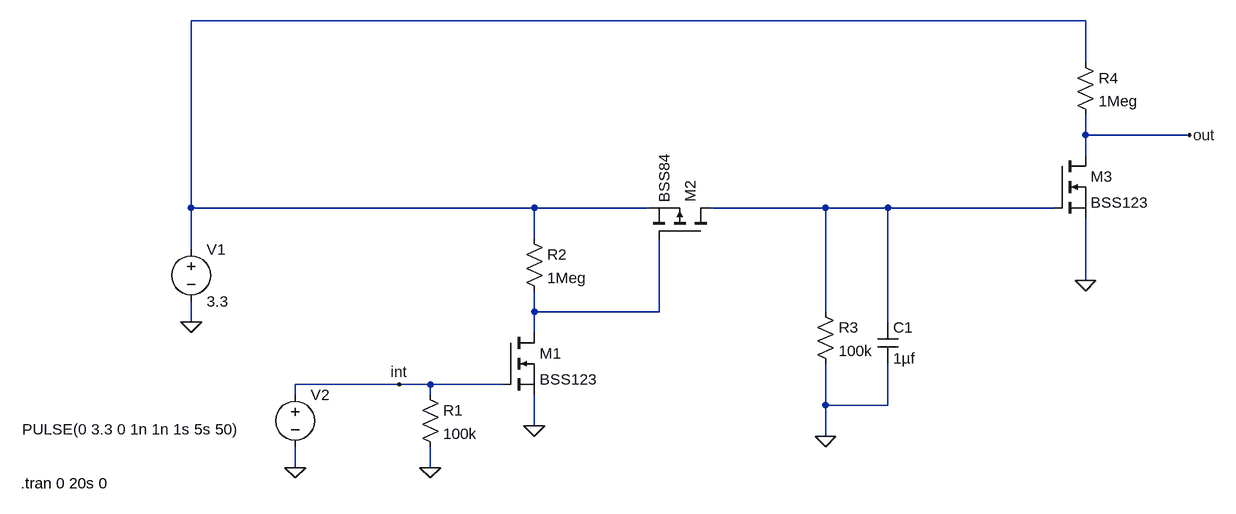
[diagram p0: schematic SW_DELAY.asc]
SW_DELAY.asc, the LTspice schematic file:
Version 4
SHEET 1 1336 680
WIRE 1120 -288 -256 -288
WIRE 1120 -224 1120 -288
WIRE 1120 -112 1120 -144
WIRE 1280 -112 1120 -112
WIRE 1120 -80 1120 -112
WIRE -256 0 -256 -288
WIRE 272 0 -256 0
WIRE 448 0 272 0
WIRE 720 0 544 0
WIRE 816 0 720 0
WIRE 1072 0 816 0
WIRE 272 48 272 0
WIRE -256 64 -256 0
WIRE 1120 112 1120 16
WIRE 272 160 272 128
WIRE 464 160 464 48
WIRE 464 160 272 160
WIRE 720 160 720 0
WIRE -256 176 -256 144
WIRE 816 176 816 0
WIRE 272 192 272 160
WIRE 64 272 -96 272
WIRE 112 272 64 272
WIRE 224 272 112 272
WIRE -96 288 -96 272
WIRE 112 288 112 272
WIRE 720 304 720 240
WIRE 816 304 816 240
WIRE 816 304 720 304
WIRE 272 336 272 288
WIRE 720 352 720 304
WIRE -96 400 -96 368
WIRE 112 400 112 368
FLAG 272 336 0
FLAG -96 400 0
FLAG -256 176 0
FLAG 112 400 0
FLAG 720 352 0
FLAG 1120 112 0
FLAG 1280 -112 out
FLAG 64 272 int
SYMBOL nmos 224 192 R0
SYMATTR InstName M1
SYMATTR Value BSS123
SYMBOL res 96 272 R0
SYMATTR InstName R1
SYMATTR Value 100k
SYMBOL pmos 544 48 M270
SYMATTR InstName M2
SYMATTR Value BSS84
SYMBOL voltage -256 48 R0
WINDOW 123 0 0 Left 0
WINDOW 39 0 0 Left 0
SYMATTR InstName V1
SYMATTR Value 3.3
SYMBOL voltage -96 272 R0
WINDOW 3 -420 69 Left 2
WINDOW 123 0 0 Left 0
WINDOW 39 0 0 Left 0
SYMATTR InstName V2
SYMATTR Value PULSE(0 3.3 0 1n 1n 1s 5s 50)
SYMBOL res 256 32 R0
SYMATTR InstName R2
SYMATTR Value 1Meg
SYMBOL res 704 144 R0
SYMATTR InstName R3
SYMATTR Value 100k
SYMBOL cap 800 176 R0
SYMATTR InstName C1
SYMATTR Value 1µf
SYMBOL nmos 1072 -80 R0
SYMATTR InstName M3
SYMATTR Value BSS123
SYMBOL res 1104 -240 R0
SYMATTR InstName R4
SYMATTR Value 1Meg
TEXT -518 424 Left 2 !.tran 0 20s 0

The netlist it stands for:
* SW_DELAY.asc
M1 N003 int 0 0 BSS123
R1 int 0 100k
M2 N002 N003 N001 N001 BSS84
V1 N001 0 3.3
V2 int 0 PULSE(0 3.3 0 1n 1n 1s 5s 50)
R2 N001 N003 1Meg
R3 N002 0 100k
C1 N002 0 1µf
M3 out N002 0 0 BSS123
R4 N001 out 1Meg
.model NMOS NMOS
.model PMOS PMOS
.lib standard.mos
.tran 0 20s 0
.backanno
.end